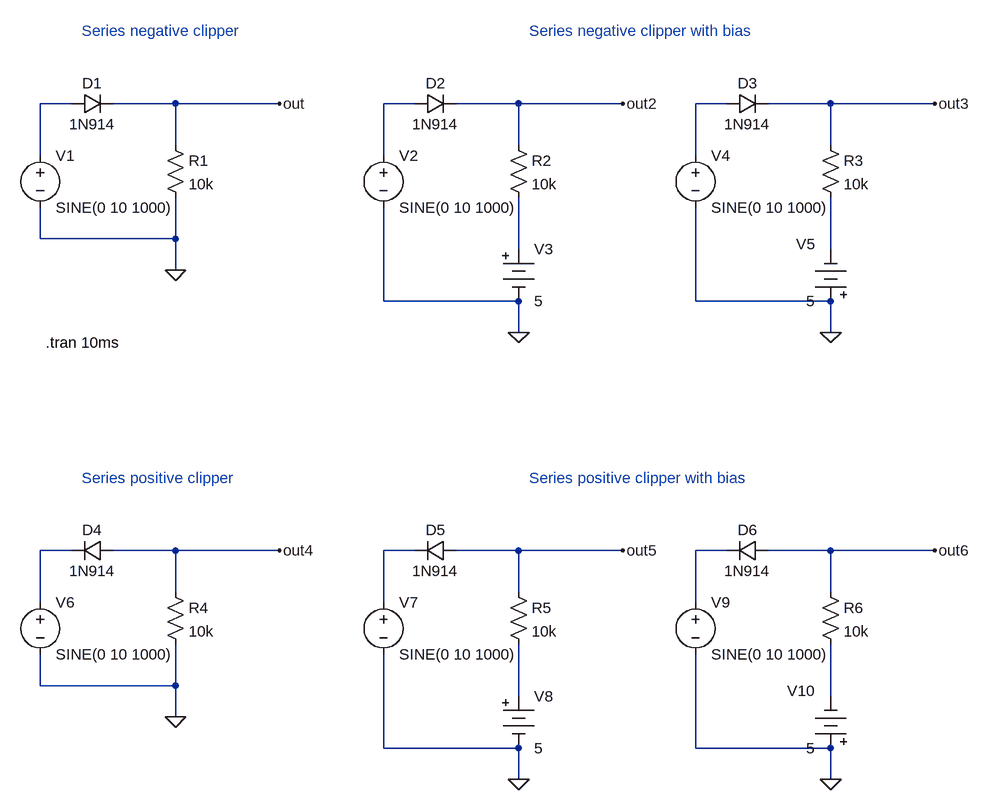
[diagram p0: schematic series positive and series negative clippers.asc]
series positive and series negative clippers.asc, the LTspice schematic file:
Version 4
SHEET 1 1756 864
WIRE 352 -208 304 -208
WIRE 512 -208 416 -208
WIRE 672 -208 512 -208
WIRE 880 -208 832 -208
WIRE 1040 -208 944 -208
WIRE 1200 -208 1040 -208
WIRE 1360 -208 1312 -208
WIRE 1520 -208 1424 -208
WIRE 1680 -208 1520 -208
WIRE 512 -144 512 -208
WIRE 1040 -144 1040 -208
WIRE 1520 -144 1520 -208
WIRE 304 -128 304 -208
WIRE 832 -128 832 -208
WIRE 1312 -128 1312 -208
WIRE 304 0 304 -48
WIRE 512 0 512 -64
WIRE 512 0 304 0
WIRE 1040 16 1040 -64
WIRE 1520 16 1520 -64
WIRE 512 48 512 0
WIRE 832 96 832 -48
WIRE 1040 96 832 96
WIRE 1312 96 1312 -48
WIRE 1520 96 1312 96
WIRE 1040 144 1040 96
WIRE 1520 144 1520 96
WIRE 352 480 304 480
WIRE 512 480 416 480
WIRE 672 480 512 480
WIRE 880 480 832 480
WIRE 1040 480 944 480
WIRE 1200 480 1040 480
WIRE 1360 480 1312 480
WIRE 1520 480 1424 480
WIRE 1680 480 1520 480
WIRE 512 544 512 480
WIRE 1040 544 1040 480
WIRE 1520 544 1520 480
WIRE 304 560 304 480
WIRE 832 560 832 480
WIRE 1312 560 1312 480
WIRE 304 688 304 640
WIRE 512 688 512 624
WIRE 512 688 304 688
WIRE 1040 704 1040 624
WIRE 1520 704 1520 624
WIRE 512 736 512 688
WIRE 832 784 832 640
WIRE 1040 784 832 784
WIRE 1312 784 1312 640
WIRE 1520 784 1312 784
WIRE 1040 832 1040 784
WIRE 1520 832 1520 784
FLAG 512 48 0
FLAG 672 -208 out
FLAG 1200 -208 out2
FLAG 1040 144 0
FLAG 1680 -208 out3
FLAG 1520 144 0
FLAG 512 736 0
FLAG 672 480 out4
FLAG 1200 480 out5
FLAG 1040 832 0
FLAG 1680 480 out6
FLAG 1520 832 0
SYMBOL diode 352 -192 R270
WINDOW 0 32 32 VTop 2
WINDOW 3 0 32 VBottom 2
SYMATTR InstName D1
SYMATTR Value 1N914
SYMBOL res 496 -160 R0
SYMATTR InstName R1
SYMATTR Value 10k
SYMBOL voltage 304 -144 R0
WINDOW 123 0 0 Left 2
WINDOW 39 0 0 Left 2
SYMATTR InstName V1
SYMATTR Value SINE(0 10 1000)
SYMBOL diode 880 -192 R270
WINDOW 0 32 32 VTop 2
WINDOW 3 0 32 VBottom 2
SYMATTR InstName D2
SYMATTR Value 1N914
SYMBOL res 1024 -160 R0
SYMATTR InstName R2
SYMATTR Value 10k
SYMBOL voltage 832 -144 R0
WINDOW 123 0 0 Left 2
WINDOW 39 0 0 Left 2
SYMATTR InstName V2
SYMATTR Value SINE(0 10 1000)
SYMBOL Misc\\battery 1040 0 R0
SYMATTR InstName V3
SYMATTR Value 5
SYMBOL diode 1360 -192 R270
WINDOW 0 32 32 VTop 2
WINDOW 3 0 32 VBottom 2
SYMATTR InstName D3
SYMATTR Value 1N914
SYMBOL res 1504 -160 R0
SYMATTR InstName R3
SYMATTR Value 10k
SYMBOL voltage 1312 -144 R0
WINDOW 123 0 0 Left 2
WINDOW 39 0 0 Left 2
SYMATTR InstName V4
SYMATTR Value SINE(0 10 1000)
SYMBOL Misc\\battery 1520 112 R180
WINDOW 0 24 104 Left 2
WINDOW 3 24 16 Left 2
SYMATTR InstName V5
SYMATTR Value 5
SYMBOL diode 416 464 R90
WINDOW 0 0 32 VBottom 2
WINDOW 3 32 32 VTop 2
SYMATTR InstName D4
SYMATTR Value 1N914
SYMBOL res 496 528 R0
SYMATTR InstName R4
SYMATTR Value 10k
SYMBOL voltage 304 544 R0
WINDOW 123 0 0 Left 2
WINDOW 39 0 0 Left 2
SYMATTR InstName V6
SYMATTR Value SINE(0 10 1000)
SYMBOL diode 944 464 R90
WINDOW 0 0 32 VBottom 2
WINDOW 3 32 32 VTop 2
SYMATTR InstName D5
SYMATTR Value 1N914
SYMBOL res 1024 528 R0
SYMATTR InstName R5
SYMATTR Value 10k
SYMBOL voltage 832 544 R0
WINDOW 123 0 0 Left 2
WINDOW 39 0 0 Left 2
SYMATTR InstName V7
SYMATTR Value SINE(0 10 1000)
SYMBOL Misc\\battery 1040 688 R0
SYMATTR InstName V8
SYMATTR Value 5
SYMBOL diode 1424 464 R90
WINDOW 0 0 32 VBottom 2
WINDOW 3 32 32 VTop 2
SYMATTR InstName D6
SYMATTR Value 1N914
SYMBOL res 1504 528 R0
SYMATTR InstName R6
SYMATTR Value 10k
SYMBOL voltage 1312 544 R0
WINDOW 123 0 0 Left 2
WINDOW 39 0 0 Left 2
SYMATTR InstName V9
SYMATTR Value SINE(0 10 1000)
SYMBOL Misc\\battery 1520 800 R180
WINDOW 0 24 104 Left 2
WINDOW 3 24 16 Left 2
SYMATTR InstName V10
SYMATTR Value 5
TEXT 312 160 Left 2 !.tran 10ms
TEXT 368 -320 Left 2 ;Series negative clipper
TEXT 1056 -320 Left 2 ;Series negative clipper with bias
TEXT 368 368 Left 2 ;Series positive clipper
TEXT 1056 368 Left 2 ;Series positive clipper with bias

The netlist it stands for:
* series positive and series negative clippers.asc
D1 N001 out 1N914
R1 out 0 10k
V1 N001 0 SINE(0 10 1000)
D2 N002 out2 1N914
R2 out2 N004 10k
V2 N002 0 SINE(0 10 1000)
V3 N004 0 5
D3 N003 out3 1N914
R3 out3 N005 10k
V4 N003 0 SINE(0 10 1000)
V5 0 N005 5
D4 out4 N006 1N914
R4 out4 0 10k
V6 N006 0 SINE(0 10 1000)
D5 out5 N007 1N914
R5 out5 N009 10k
V7 N007 0 SINE(0 10 1000)
V8 N009 0 5
D6 out6 N008 1N914
R6 out6 N010 10k
V9 N008 0 SINE(0 10 1000)
V10 0 N010 5
.model D D
.lib standard.dio
.tran 10ms
* Series negative clipper
* Series negative clipper with bias
* Series positive clipper
* Series positive clipper with bias
.backanno
.end